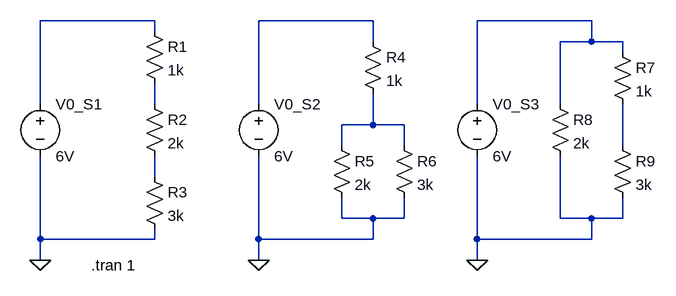
[diagram p0: schematic Resistor_Network_Exercises_V001.asc]
Resistor_Network_Exercises_V001.asc, the LTspice schematic file:
Version 4
SHEET 1 880 680
WIRE 96 48 -80 48
WIRE 432 48 256 48
WIRE 768 48 592 48
WIRE 96 64 96 48
WIRE 432 80 432 48
WIRE 768 80 768 48
WIRE 768 80 720 80
WIRE 816 80 768 80
WIRE 816 96 816 80
WIRE -80 176 -80 48
WIRE 96 176 96 144
WIRE 256 176 256 48
WIRE 592 176 592 48
WIRE 720 176 720 80
WIRE 432 208 432 160
WIRE 432 208 384 208
WIRE 480 208 432 208
WIRE 384 240 384 208
WIRE 480 240 480 208
WIRE 816 240 816 176
WIRE 96 288 96 256
WIRE 384 352 384 320
WIRE 432 352 384 352
WIRE 480 352 480 320
WIRE 480 352 432 352
WIRE 720 352 720 256
WIRE 768 352 720 352
WIRE 816 352 816 320
WIRE 816 352 768 352
WIRE -80 384 -80 256
WIRE 96 384 96 368
WIRE 96 384 -80 384
WIRE 256 384 256 256
WIRE 432 384 432 352
WIRE 432 384 256 384
WIRE 592 384 592 256
WIRE 768 384 768 352
WIRE 768 384 592 384
WIRE -80 416 -80 384
WIRE 256 416 256 384
WIRE 592 416 592 384
FLAG -80 416 0
FLAG 256 416 0
FLAG 592 416 0
SYMBOL res 80 48 R0
SYMATTR InstName R1
SYMATTR Value 1k
SYMBOL res 80 160 R0
SYMATTR InstName R2
SYMATTR Value 2k
SYMBOL res 80 272 R0
SYMATTR InstName R3
SYMATTR Value 3k
SYMBOL voltage -80 160 R0
WINDOW 123 0 0 Left 0
WINDOW 39 0 0 Left 0
SYMATTR InstName V0_S1
SYMATTR Value 6V
SYMBOL res 416 64 R0
SYMATTR InstName R4
SYMATTR Value 1k
SYMBOL res 368 224 R0
SYMATTR InstName R5
SYMATTR Value 2k
SYMBOL res 464 224 R0
SYMATTR InstName R6
SYMATTR Value 3k
SYMBOL voltage 256 160 R0
WINDOW 123 0 0 Left 0
WINDOW 39 0 0 Left 0
SYMATTR InstName V0_S2
SYMATTR Value 6V
SYMBOL res 800 80 R0
SYMATTR InstName R7
SYMATTR Value 1k
SYMBOL res 704 160 R0
SYMATTR InstName R8
SYMATTR Value 2k
SYMBOL res 800 224 R0
SYMATTR InstName R9
SYMATTR Value 3k
SYMBOL voltage 592 160 R0
WINDOW 123 0 0 Left 0
WINDOW 39 0 0 Left 0
SYMATTR InstName V0_S3
SYMATTR Value 6V
TEXT -2 424 Left 2 !.tran 1

The netlist it stands for:
* Resistor_Network_Exercises_V001.asc
R1 N001 N004 1k
R2 N004 N007 2k
R3 N007 0 3k
V0_S1 N001 0 6V
R4 N002 N005 1k
R5 N005 0 2k
R6 N005 0 3k
V0_S2 N002 0 6V
R7 N003 N006 1k
R8 N003 0 2k
R9 N006 0 3k
V0_S3 N003 0 6V
.tran 1
.backanno
.end